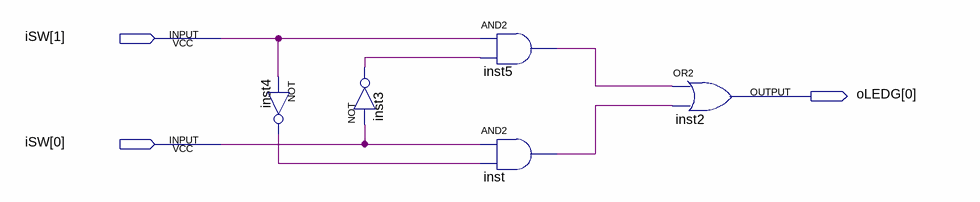
[diagram p0: schematic sheet]
// Quartus schematic Light.bdf as structural Verilog: 5 symbols, 3 pins
module Light (
  input  [1:0] iSW,
  output [0:0] oLEDG
);

  wire inst3_out, inst4_out, inst5_out, inst_out;

  not inst4 (inst4_out, iSW[1]);
  not inst3 (inst3_out, iSW[0]);
  and inst5 (inst5_out, iSW[1], inst3_out);
  and inst (inst_out, iSW[0], inst4_out);
  or inst2 (oLEDG[0], inst5_out, inst_out);
endmodule
